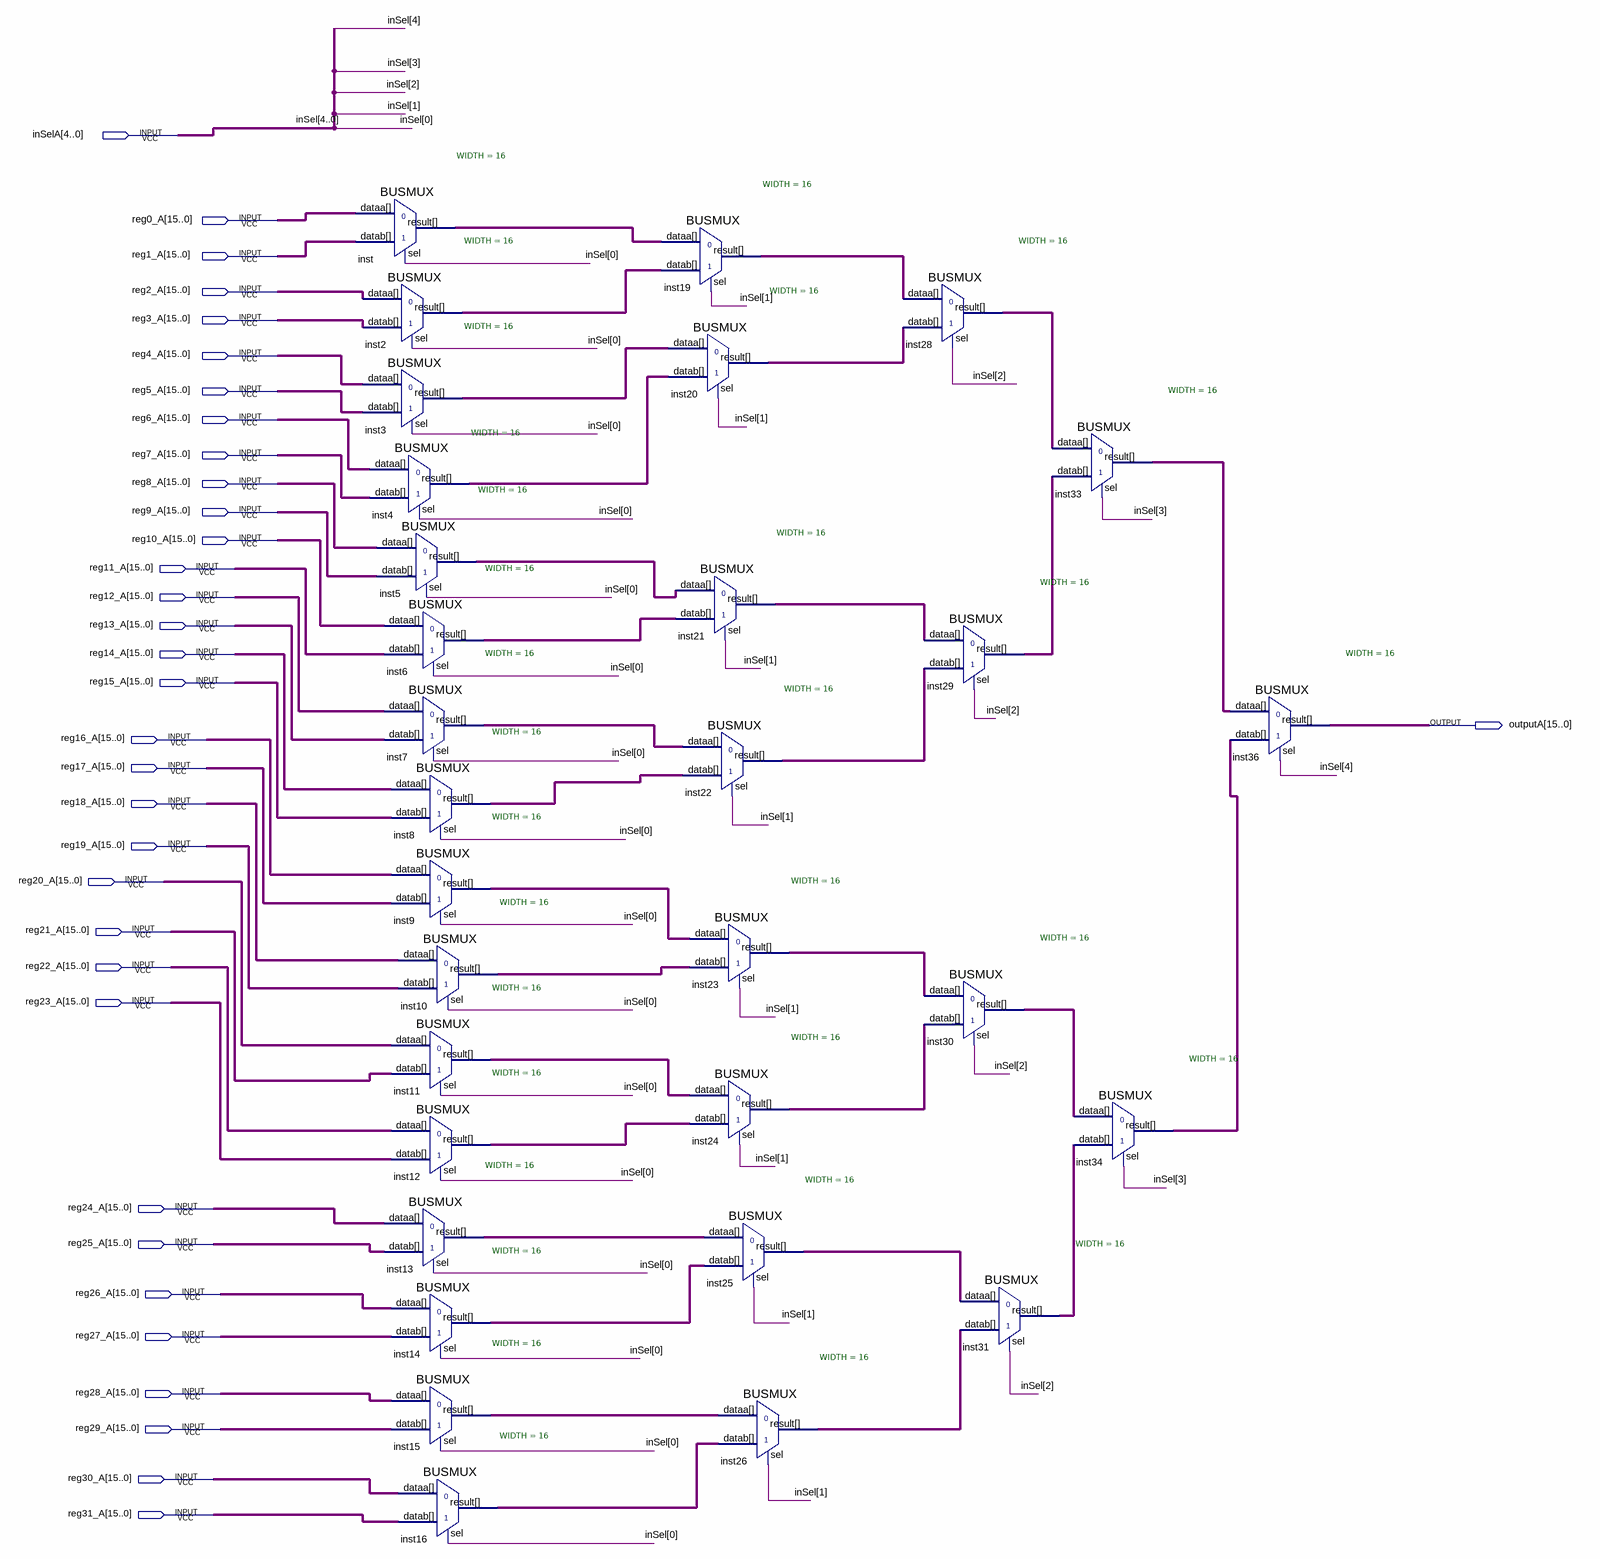
[diagram p0: schematic sheet]
// Quartus schematic ev20B3BUSA.bdf as structural Verilog: 31 symbols, 34 pins
module ev20B3BUSA (
  input  [4:0] inSelA,
  input  [15:0] reg0_A,
  input  [15:0] reg1_A,
  input  [15:0] reg2_A,
  input  [15:0] reg3_A,
  input  [15:0] reg4_A,
  input  [15:0] reg5_A,
  input  [15:0] reg6_A,
  input  [15:0] reg7_A,
  input  [15:0] reg8_A,
  input  [15:0] reg9_A,
  input  [15:0] reg10_A,
  input  [15:0] reg11_A,
  input  [15:0] reg12_A,
  input  [15:0] reg13_A,
  input  [15:0] reg14_A,
  input  [15:0] reg15_A,
  input  [15:0] reg16_A,
  input  [15:0] reg17_A,
  input  [15:0] reg18_A,
  input  [15:0] reg19_A,
  input  [15:0] reg20_A,
  input  [15:0] reg21_A,
  input  [15:0] reg22_A,
  input  [15:0] reg23_A,
  input  [15:0] reg24_A,
  input  [15:0] reg25_A,
  input  [15:0] reg26_A,
  input  [15:0] reg27_A,
  input  [15:0] reg28_A,
  input  [15:0] reg29_A,
  input  [15:0] reg30_A,
  input  [15:0] reg31_A,
  output [15:0] outputA
);

  wire [15:0] inst2_result, inst3_result, inst4_result, inst5_result, inst6_result, inst7_result,
       inst8_result, inst9_result, inst10_result, inst11_result, inst12_result, inst13_result, inst14_result,
       inst15_result, inst16_result, inst19_result, inst20_result, inst21_result, inst22_result,
       inst23_result, inst24_result, inst25_result, inst26_result, inst28_result, inst29_result,
       inst30_result, inst31_result, inst33_result, inst34_result, inst_result;

  BUSMUX #(.WIDTH(16)) inst (.datab(reg1_A), .sel(inSelA[0]), .dataa(reg0_A), .result(inst_result));
  BUSMUX #(.WIDTH(16)) inst2 (.datab(reg3_A), .sel(inSelA[0]), .dataa(reg2_A), .result(inst2_result));
  BUSMUX #(.WIDTH(16)) inst3 (.datab(reg5_A), .sel(inSelA[0]), .dataa(reg4_A), .result(inst3_result));
  BUSMUX #(.WIDTH(16)) inst4 (.datab(reg7_A), .sel(inSelA[0]), .dataa(reg6_A), .result(inst4_result));
  BUSMUX #(.WIDTH(16)) inst5 (.datab(reg9_A), .sel(inSelA[0]), .dataa(reg8_A), .result(inst5_result));
  BUSMUX #(.WIDTH(16)) inst6 (.datab(reg11_A), .sel(inSelA[0]), .dataa(reg10_A), .result(inst6_result));
  BUSMUX #(.WIDTH(16)) inst7 (.datab(reg13_A), .sel(inSelA[0]), .dataa(reg12_A), .result(inst7_result));
  BUSMUX #(.WIDTH(16)) inst8 (.datab(reg15_A), .sel(inSelA[0]), .dataa(reg14_A), .result(inst8_result));
  BUSMUX #(.WIDTH(16)) inst9 (.datab(reg17_A), .sel(inSelA[0]), .dataa(reg16_A), .result(inst9_result));
  BUSMUX #(.WIDTH(16)) inst10 (.datab(reg19_A), .sel(inSelA[0]), .dataa(reg18_A), .result(inst10_result));
  BUSMUX #(.WIDTH(16)) inst11 (.datab(reg21_A), .sel(inSelA[0]), .dataa(reg20_A), .result(inst11_result));
  BUSMUX #(.WIDTH(16)) inst12 (.datab(reg23_A), .sel(inSelA[0]), .dataa(reg22_A), .result(inst12_result));
  BUSMUX #(.WIDTH(16)) inst13 (.datab(reg25_A), .sel(inSelA[0]), .dataa(reg24_A), .result(inst13_result));
  BUSMUX #(.WIDTH(16)) inst14 (.datab(reg27_A), .sel(inSelA[0]), .dataa(reg26_A), .result(inst14_result));
  BUSMUX #(.WIDTH(16)) inst15 (.datab(reg29_A), .sel(inSelA[0]), .dataa(reg28_A), .result(inst15_result));
  BUSMUX #(.WIDTH(16)) inst16 (.datab(reg31_A), .sel(inSelA[0]), .dataa(reg30_A), .result(inst16_result));
  BUSMUX #(.WIDTH(16)) inst19 (.datab(inst2_result), .sel(inSelA[1]), .dataa(inst_result), .result(inst19_result));
  BUSMUX #(.WIDTH(16)) inst20 (.datab(inst4_result), .sel(inSelA[1]), .dataa(inst3_result), .result(inst20_result));
  BUSMUX #(.WIDTH(16)) inst21 (.datab(inst6_result), .sel(inSelA[1]), .dataa(inst5_result), .result(inst21_result));
  BUSMUX #(.WIDTH(16)) inst22 (.datab(inst8_result), .sel(inSelA[1]), .dataa(inst7_result), .result(inst22_result));
  BUSMUX #(.WIDTH(16)) inst23 (.datab(inst10_result), .sel(inSelA[1]), .dataa(inst9_result), .result(inst23_result));
  BUSMUX #(.WIDTH(16)) inst24 (.datab(inst12_result), .sel(inSelA[1]), .dataa(inst11_result), .result(inst24_result));
  BUSMUX #(.WIDTH(16)) inst25 (.datab(inst14_result), .sel(inSelA[1]), .dataa(inst13_result), .result(inst25_result));
  BUSMUX #(.WIDTH(16)) inst26 (.datab(inst16_result), .sel(inSelA[1]), .dataa(inst15_result), .result(inst26_result));
  BUSMUX #(.WIDTH(16)) inst28 (.datab(inst20_result), .sel(inSelA[2]), .dataa(inst19_result), .result(inst28_result));
  BUSMUX #(.WIDTH(16)) inst29 (.datab(inst22_result), .sel(inSelA[2]), .dataa(inst21_result), .result(inst29_result));
  BUSMUX #(.WIDTH(16)) inst30 (.datab(inst24_result), .sel(inSelA[2]), .dataa(inst23_result), .result(inst30_result));
  BUSMUX #(.WIDTH(16)) inst31 (.datab(inst26_result), .sel(inSelA[2]), .dataa(inst25_result), .result(inst31_result));
  BUSMUX #(.WIDTH(16)) inst33 (.datab(inst29_result), .sel(inSelA[3]), .dataa(inst28_result), .result(inst33_result));
  BUSMUX #(.WIDTH(16)) inst34 (.datab(inst31_result), .sel(inSelA[3]), .dataa(inst30_result), .result(inst34_result));
  BUSMUX #(.WIDTH(16)) inst36 (.datab(inst34_result), .sel(inSelA[4]), .dataa(inst33_result), .result(outputA));

  // Other names for the same wires on the sheet: inSel[4:0] = inSelA
endmodule
